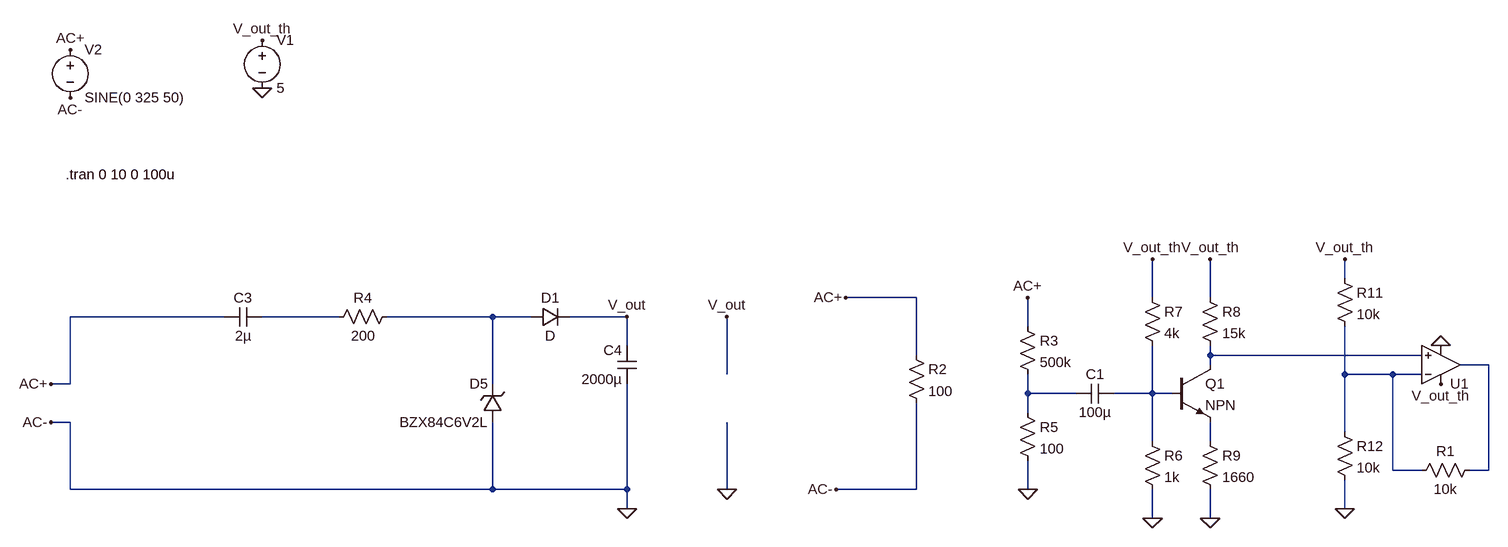
[diagram p0: schematic converter_symetric.asc]
converter_symetric.asc, the LTspice schematic file:
Version 4
SHEET 1 948 692
WIRE 704 160 704 128
WIRE -400 192 -720 192
WIRE 160 192 160 128
WIRE 256 192 256 128
WIRE -2160 224 -2416 224
WIRE -1968 224 -2096 224
WIRE -1712 224 -1888 224
WIRE -1648 224 -1712 224
WIRE -1488 224 -1584 224
WIRE -48 240 -48 192
WIRE -1488 272 -1488 224
WIRE -400 288 -400 192
WIRE 256 288 256 272
WIRE 832 288 256 288
WIRE 256 304 256 288
WIRE 944 304 896 304
WIRE -1008 320 -1008 224
WIRE 704 320 704 240
WIRE 784 320 704 320
WIRE 832 320 784 320
WIRE -2416 336 -2416 224
WIRE -2416 336 -2448 336
WIRE -1712 336 -1712 224
WIRE -48 352 -48 320
WIRE 32 352 -48 352
WIRE 160 352 160 272
WIRE 160 352 96 352
WIRE 192 352 160 352
WIRE -48 384 -48 352
WIRE -2416 400 -2448 400
WIRE 704 416 704 320
WIRE 160 432 160 352
WIRE 256 432 256 400
WIRE 784 480 784 320
WIRE 832 480 784 480
WIRE 944 480 944 304
WIRE 944 480 912 480
WIRE -2416 512 -2416 400
WIRE -1712 512 -1712 400
WIRE -1712 512 -2416 512
WIRE -1488 512 -1488 336
WIRE -1488 512 -1712 512
WIRE -1008 512 -1008 400
WIRE -400 512 -400 368
WIRE -400 512 -736 512
WIRE -48 512 -48 464
WIRE -1488 544 -1488 512
WIRE 704 544 704 496
WIRE 160 560 160 512
WIRE 256 560 256 512
FLAG -2416 -288 AC+
FLAG -2416 -208 AC-
FLAG -2448 336 AC+
FLAG -2448 400 AC-
FLAG -1488 224 V_out
FLAG -1488 544 0
FLAG -1008 224 V_out
FLAG -1008 512 0
FLAG -720 192 AC+
FLAG -736 512 AC-
FLAG -48 192 AC+
FLAG -48 512 0
FLAG 160 560 0
FLAG 256 560 0
FLAG -2096 -304 V_out_th
FLAG -2096 -224 0
FLAG 160 128 V_out_th
FLAG 256 128 V_out_th
FLAG 864 336 V_out_th
FLAG 864 272 0
FLAG 704 128 V_out_th
FLAG 704 544 0
SYMBOL voltage -2416 -304 R0
WINDOW 123 0 0 Left 0
WINDOW 39 0 0 Left 0
SYMATTR InstName V2
SYMATTR Value SINE(0 325 50)
SYMBOL cap -2096 208 R90
WINDOW 0 0 32 VBottom 2
WINDOW 3 32 32 VTop 2
SYMATTR InstName C3
SYMATTR Value 2µ
SYMBOL res -1872 208 R90
WINDOW 0 0 56 VBottom 2
WINDOW 3 32 56 VTop 2
SYMATTR InstName R4
SYMATTR Value 200
SYMBOL zener -1696 400 R180
WINDOW 0 24 64 Left 2
WINDOW 3 24 0 Left 2
SYMATTR InstName D5
SYMATTR Value BZX84C6V2L
SYMATTR Description Diode
SYMATTR Type diode
SYMBOL cap -1472 336 R180
WINDOW 0 24 56 Left 2
WINDOW 3 24 8 Left 2
SYMATTR InstName C4
SYMATTR Value 2000µ
SYMATTR SpiceLine IC 6
SYMBOL diode -1648 240 R270
WINDOW 0 32 32 VTop 2
WINDOW 3 0 32 VBottom 2
SYMATTR InstName D1
SYMBOL res -416 272 R0
SYMATTR InstName R2
SYMATTR Value 100
SYMBOL res -64 224 R0
SYMATTR InstName R3
SYMATTR Value 500k
SYMBOL res -64 368 R0
SYMATTR InstName R5
SYMATTR Value 100
SYMBOL npn 192 304 R0
SYMATTR InstName Q1
SYMBOL res 144 416 R0
SYMATTR InstName R6
SYMATTR Value 1k
SYMBOL res 144 176 R0
SYMATTR InstName R7
SYMATTR Value 4k
SYMBOL res 240 176 R0
SYMATTR InstName R8
SYMATTR Value 15k
SYMBOL res 240 416 R0
SYMATTR InstName R9
SYMATTR Value 1660
SYMBOL cap 96 336 R90
WINDOW 0 0 32 VBottom 2
WINDOW 3 32 32 VTop 2
SYMATTR InstName C1
SYMATTR Value 100µ
SYMBOL voltage -2096 -320 R0
WINDOW 123 0 0 Left 0
WINDOW 39 0 0 Left 0
SYMATTR InstName V1
SYMATTR Value 5
SYMBOL OpAmps\\UniversalOpamp2 864 304 M180
SYMATTR InstName U1
SYMBOL res 688 144 R0
SYMATTR InstName R11
SYMATTR Value 10k
SYMBOL res 688 400 R0
SYMATTR InstName R12
SYMATTR Value 10k
SYMBOL res 928 464 R90
WINDOW 0 0 56 VBottom 2
WINDOW 3 32 56 VTop 2
SYMATTR InstName R1
SYMATTR Value 10k
TEXT -2424 -80 Left 2 !.tran 0 10 0 100u

The netlist it stands for:
* converter_symetric.asc
V2 AC+ 0 SINE(0 325 50)
C3 N001 AC+ 2µ
R4 N002 N001 200
D5 0 N002 BZX84C6V2L
C4 0 V_out 2000µ IC 6
D1 N002 V_out D
R2 AC+ 0 100
R3 AC+ N006 500k
R5 N006 0 100
Q1 N003 N007 N008 0 NPN
R6 N007 0 1k
R7 V_out_th N007 4k
R8 V_out_th N003 15k
R9 N008 0 1660
C1 N007 N006 100µ
V1 V_out_th 0 5
XU1 N003 N005 V_out_th 0 N004 level.2 Avol=1Meg GBW=10Meg Slew=10Meg ilimit=25m rail=0 Vos=0 phimargin=45 en=0 enk=0 in=0 ink=0 Rin=500Meg  ; pins IN+ IN- V+ V- OUT
R11 V_out_th N005 10k
R12 N005 0 10k
R1 N004 N005 10k
.model D D
.lib standard.dio
.model NPN NPN
.model PNP PNP
.lib standard.bjt
.tran 0 10 0 100u
.lib UniversalOpamps2.sub
.backanno
.end